# Altium schematic sheet pulsewidth1.SchDoc
size A4; SheetNumber: 1; SheetTotal: 4
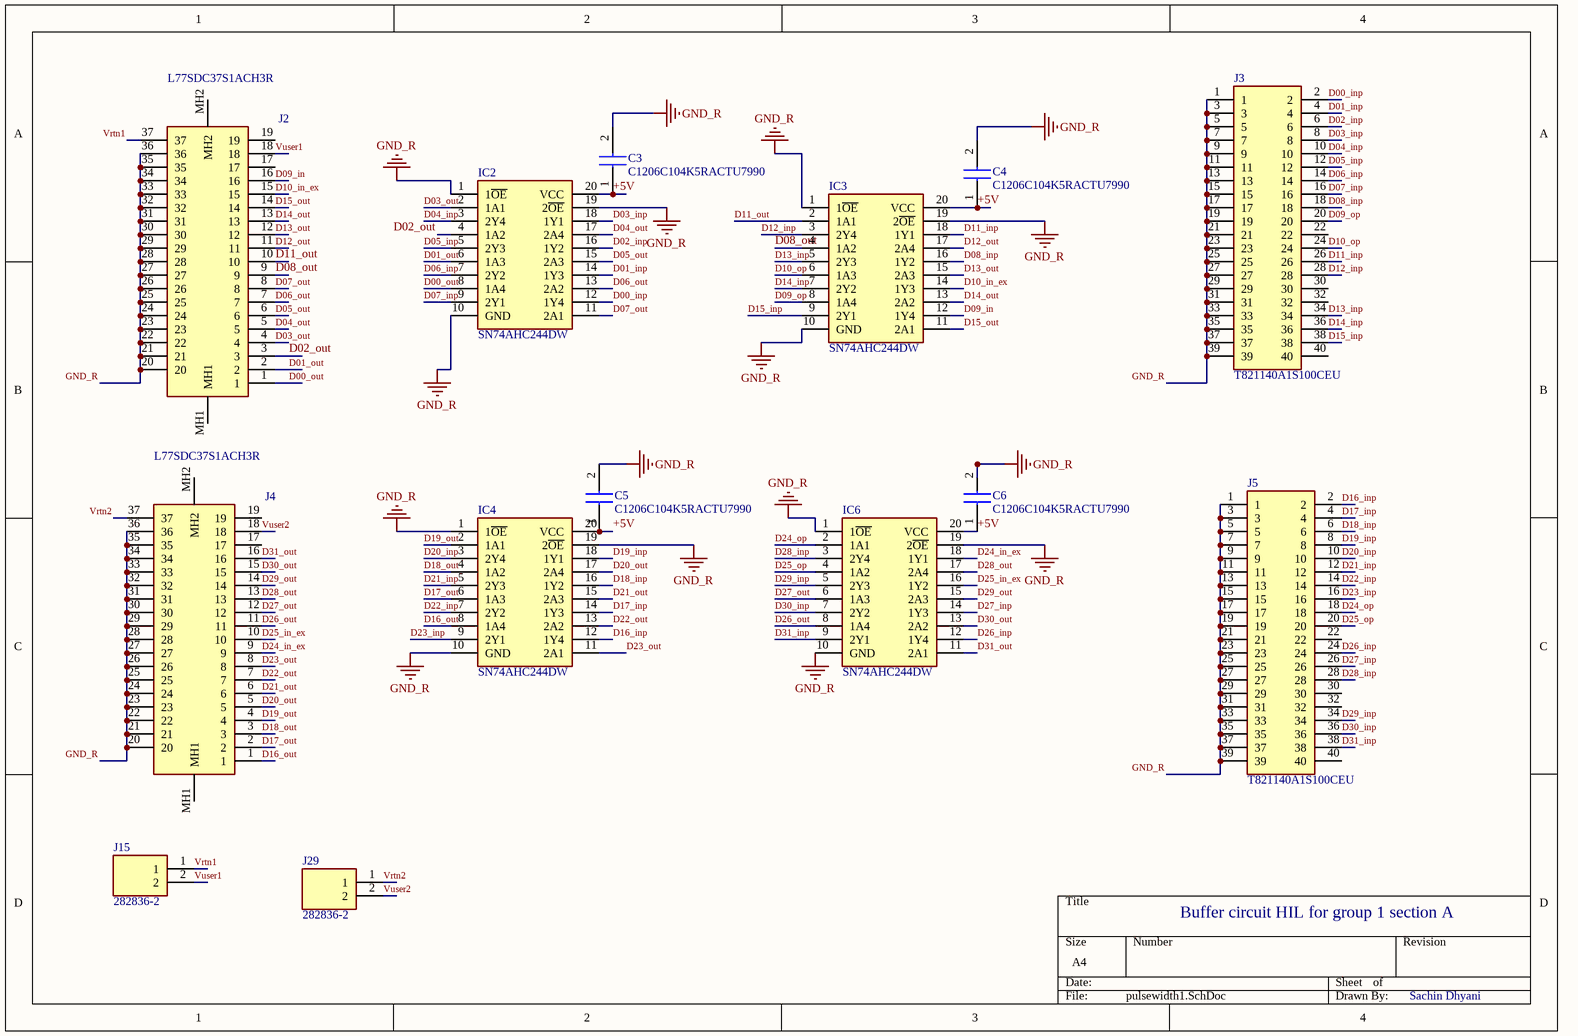
[diagram p0: pulsewidth1.SchDoc]

## Parts
C3  C1206C104K5RACTU7990  [CAPC3216X88N]
C4  C1206C104K5RACTU7990  [CAPC3216X88N]
C5  C1206C104K5RACTU7990  [CAPC3216X88N]
C6  C1206C104K5RACTU7990  [CAPC3216X88N]
IC2  SN74AHC244DW  [SOIC127P1030X265-20N]
IC3  SN74AHC244DW  [SOIC127P1030X265-20N]
IC4  SN74AHC244DW  [SOIC127P1030X265-20N]
IC6  SN74AHC244DW  [SOIC127P1030X265-20N]
J2  L77SDC37S1ACH3R  [L77SDC37S1ACH3R]
J3  T821140A1S100CEU  [SHDR40W64P254X254_2X20_5842X895X915P]
J4  L77SDC37S1ACH3R  [L77SDC37S1ACH3R]
J5  T821140A1S100CEU  [SHDR40W64P254X254_2X20_5842X895X915P]
J15  282836-2  [2828362]
J29  282836-2  [2828362]

## Nets
GND_R: C3.2 C4.2 C5.2 C6.2 IC2.1(1~{OE}) IC2.10(GND) IC2.19(2~{OE}) IC3.1(1~{OE}) IC3.10(GND) IC3.19(2~{OE}) IC4.1(1~{OE}) IC4.10(GND) IC4.19(2~{OE}) IC6.1(1~{OE}) IC6.10(GND) IC6.19(2~{OE}) J2.20 J2.21 J2.22 J2.23 J2.24 J2.25 J2.26 J2.27 J2.28 J2.29 J2.30 J2.31 J2.32 J2.33 J2.34 J2.35 J2.36 J3.1 J3.3 J3.5 J3.7 J3.9 J3.11 J3.13 J3.15 J3.17 J3.19 J3.21 J3.23 J3.25 J3.27 J3.29 J3.31 J3.33 J3.35 J3.37 J3.39 J4.20 J4.21 J4.22 J4.23 J4.24 J4.25 J4.26 J4.27 J4.28 J4.29 J4.30 J4.31 J4.32 J4.33 J4.34 J4.35 J4.36 J5.1 J5.3 J5.5 J5.7 J5.9 J5.11 J5.13 J5.15 J5.17 J5.19 J5.21 J5.23 J5.25 J5.27 J5.29 J5.31 J5.33 J5.35 J5.37 J5.39
+5V: C3.1 C4.1 C5.1 C6.1 IC2.20(VCC) IC3.20(VCC) IC4.20(VCC) IC6.20(VCC)
D00_inp: IC2.12(1Y4) J3.2
D00_out: IC2.8(1A4) J2.1
D01_inp: IC2.14(1Y3) J3.4
D01_out: IC2.6(1A3) J2.2
D02_inp: IC2.16(1Y2) J3.6
D02_out: IC2.4(1A2) J2.3
D03_inp: IC2.18(1Y1) J3.8
D03_out: IC2.2(1A1) J2.4
D04_inp: IC2.3(2Y4) J3.10
D04_out: IC2.17(2A4) J2.5
D05_inp: IC2.5(2Y3) J3.12
D05_out: IC2.15(2A3) J2.6
D06_inp: IC2.7(2Y2) J3.14
D06_out: IC2.13(2A2) J2.7
D07_inp: IC2.9(2Y1) J3.16
D07_out: IC2.11(2A1) J2.8
D08_inp: IC3.16(1Y2) J3.18
D08_out: IC3.4(1A2) J2.9
D09_in: IC3.12(1Y4) J2.16
D09_op: IC3.8(1A4) J3.20
D10_in_ex: IC3.14(1Y3) J2.15
D10_op: IC3.6(1A3) J3.24
D11_inp: IC3.18(1Y1) J3.26
D11_out: IC3.2(1A1) J2.10
D12_inp: IC3.3(2Y4) J3.28
D12_out: IC3.17(2A4) J2.11
D13_inp: IC3.5(2Y3) J3.34
D13_out: IC3.15(2A3) J2.12
D14_inp: IC3.7(2Y2) J3.36
D14_out: IC3.13(2A2) J2.13
D15_inp: IC3.9(2Y1) J3.38
D15_out: IC3.11(2A1) J2.14
D16_inp: IC4.12(1Y4) J5.2
D16_out: IC4.8(1A4) J4.1
D17_inp: IC4.14(1Y3) J5.4
D17_out: IC4.6(1A3) J4.2
D18_inp: IC4.16(1Y2) J5.6
D18_out: IC4.4(1A2) J4.3
D19_inp: IC4.18(1Y1) J5.8
D19_out: IC4.2(1A1) J4.4
D20_inp: IC4.3(2Y4) J5.10
D20_out: IC4.17(2A4) J4.5
D21_inp: IC4.5(2Y3) J5.12
D21_out: IC4.15(2A3) J4.6
D22_inp: IC4.7(2Y2) J5.14
D22_out: IC4.13(2A2) J4.7
D23_inp: IC4.9(2Y1) J5.16
D23_out: IC4.11(2A1) J4.8
D24_in_ex: IC6.18(1Y1) J4.9
D24_op: IC6.2(1A1) J5.18
D25_in_ex: IC6.16(1Y2) J4.10
D25_op: IC6.4(1A2) J5.20
D26_inp: IC6.12(1Y4) J5.24
D26_out: IC6.8(1A4) J4.11
D27_inp: IC6.14(1Y3) J5.26
D27_out: IC6.6(1A3) J4.12
D28_inp: IC6.3(2Y4) J5.28
D28_out: IC6.17(2A4) J4.13
D29_inp: IC6.5(2Y3) J5.34
D29_out: IC6.15(2A3) J4.14
D30_inp: IC6.7(2Y2) J5.36
D30_out: IC6.13(2A2) J4.15
D31_inp: IC6.9(2Y1) J5.38
D31_out: IC6.11(2A1) J4.16
Vrtn1: J2.37 J15.1
Vrtn2: J4.37 J29.1
Vuser1: J2.18 J15.2
Vuser2: J4.18 J29.2

Not connected (* = marked no-connect by the designer): J2 17 19 MH1 MH2; J3 22 30 32 40; J4 17 19 MH1 MH2; J5 22 30 32 40

## Notes on the sheet
- Buffer circuit HIL for group 1 section A
- Sachin Dhyani

## Library data of the parts
C3-C6 = C1206C104K5RACTU7990: Capacitor; Manufacturer_Name: KEMET; Datasheet Link: https://api.kemet.com/component-edge/download/specsheet/C1206C104K5RACTU.pdf; Height: 0.88mm; Manufacturer_Part_Number: C1206C104K5RACTU7990; Arrow Part Number: C1206C104K5RACTU7990; Arrow Price/Stock: https://www.arrow.com/en/products/c1206c104k5ractu7990/kemet-corporation?utm_currency=USD&region=nac
IC2-IC4 IC6 = SN74AHC244DW: Integrated Circuit; Manufacturer_Name: Texas Instruments; Datasheet Link: https://datasheet.datasheetarchive.com/originals/distributors/Datasheets-301/18405.pdf; Height: 2.65mm; Manufacturer_Part_Number: SN74AHC244DW; Mouser Part Number: 595-SN74AHC244DW; Mouser Price/Stock: https://www.mouser.co.uk/ProductDetail/Texas-Instruments/SN74AHC244DW?qs=j%2FZo4ajzVJKtLyxm%252BX3lew%3D%3D; Arrow Part Number: SN74AHC244DW; Arrow Price/Stock: https://www.arrow.com/en/products/sn74ahc244dw/texas-instruments?region=nac
J2 J4 = L77SDC37S1ACH3R: Connector; Manufacturer_Name: Amphenol; Datasheet Link: https://cdn.amphenol-cs.com/media/wysiwyg/files/drawing/l77sdxxxs1ach3r.pdf; Height: 12.93mm; Manufacturer_Part_Number: L77SDC37S1ACH3R; Mouser Part Number: 523-L77SDC37S1ACH3R; Mouser Price/Stock: https://www.mouser.co.uk/ProductDetail/Amphenol-Commercial-Products/L77SDC37S1ACH3R?qs=mq7kV%2Fq8lk7HpO2gUh7qRA%3D%3D
J3 J5 = T821140A1S100CEU: Connector; Manufacturer_Name: Amphenol; Datasheet Link: http://www.farnell.com/datasheets/1648843.pdf; Height: 9.15mm; Manufacturer_Part_Number: T821140A1S100CEU; Mouser Part Number: N/A; Mouser Price/Stock: https://www.mouser.co.uk/ProductDetail/Amphenol/T821140A1S100CEU?qs=%252BRAvXJslkuDIVA7vEt1SFA%3D%3D; Arrow Part Number: T821140A1S100CEU; Arrow Price/Stock: https://www.arrow.com/en/products/t821140a1s100ceu/amphenol-fci?region=europe
J15 J29 = 282836-2: Connector; Manufacturer_Name: TE Connectivity; Datasheet Link: https://www.te.com/commerce/DocumentDelivery/DDEController?Action=srchrtrv&DocNm=1-1773458-1_EURO_STYLE_QRG&DocType=Data%20Sheet&DocLang=English&PartCntxt=282836-2&DocFormat=pdf; Height: 10mm; Manufacturer_Part_Number: 282836-2; Mouser Part Number: 571-2828362; Mouser Price/Stock: https://www.mouser.co.uk/ProductDetail/TE-Connectivity/282836-2?qs=A%252Bip%252BNCYi6Ohx9vaQ1l4dg%3D%3D; Arrow Part Number: 282836-2; Arrow Price/Stock: https://www.arrow.com/en/products/282836-2/te-connectivity?utm_currency=USD&region=nac